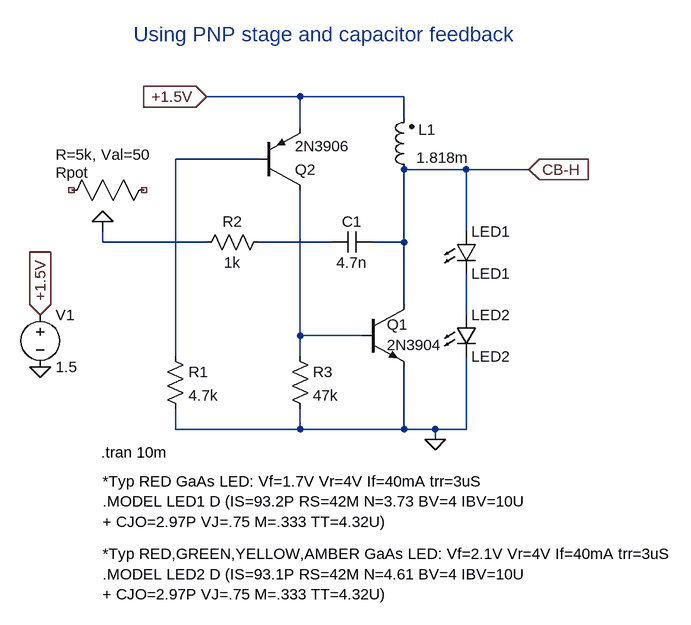
[diagram p0: schematic using_pnp_stage_and_cap_feedback_ltspice.asc]
using_pnp_stage_and_cap_feedback_ltspice.asc, the LTspice schematic file:
Version 4
SHEET 1 900 968
WIRE 112 128 -32 128
WIRE 272 128 112 128
WIRE 272 160 272 128
WIRE 112 176 112 128
WIRE 48 224 -80 224
WIRE 368 240 272 240
WIRE 464 240 368 240
WIRE 368 336 368 240
WIRE -192 352 -192 336
WIRE -32 352 -192 352
WIRE 160 352 48 352
WIRE 272 352 272 240
WIRE 272 352 224 352
WIRE 272 448 272 352
WIRE 368 464 368 400
WIRE 112 496 112 272
WIRE 208 496 112 496
WIRE -80 528 -80 224
WIRE 112 528 112 496
WIRE -80 640 -80 608
WIRE 112 640 112 608
WIRE 112 640 -80 640
WIRE 272 640 272 544
WIRE 272 640 112 640
WIRE 320 640 272 640
WIRE 368 640 368 528
WIRE 368 640 320 640
WIRE 320 656 320 640
FLAG -32 128 +1.5V
IOPIN -32 128 In
FLAG 320 656 0
FLAG 464 240 CB-H
IOPIN 464 240 In
FLAG -288 544 0
FLAG -288 464 +1.5V
IOPIN -288 464 In
SYMBOL ind2 288 256 R180
WINDOW 0 -33 77 Left 2
WINDOW 3 -3 34 Right 2
SYMATTR InstName L1
SYMATTR Value 1.818m
SYMATTR Type ind
SYMBOL LED 352 336 R0
SYMATTR InstName LED1
SYMATTR Value LED1
SYMBOL LED 352 464 R0
SYMATTR InstName LED2
SYMATTR Value LED2
SYMBOL npn 208 448 R0
WINDOW 0 38 31 Left 2
WINDOW 3 38 62 Left 2
SYMATTR InstName Q1
SYMATTR Value 2N3904
SYMBOL res 64 336 R90
WINDOW 0 0 56 VBottom 2
WINDOW 3 32 56 VTop 2
SYMATTR InstName R2
SYMATTR Value 1k
SYMBOL potentiometer -224 288 R270
WINDOW 0 43 -40 VRight 2
WINDOW 39 71 -40 VRight 2
SYMATTR InstName Rpot
SYMATTR SpiceLine R=5k, Val=50
SYMBOL pnp 48 272 M180
SYMATTR InstName Q2
SYMATTR Value 2N3906
SYMBOL res 96 512 R0
SYMATTR InstName R3
SYMATTR Value 47k
SYMBOL res -96 512 R0
SYMATTR InstName R1
SYMATTR Value 4.7k
SYMBOL cap 224 336 R90
WINDOW 0 0 32 VBottom 2
WINDOW 3 32 32 VTop 2
SYMATTR InstName C1
SYMATTR Value 4.7n
SYMBOL voltage -288 448 R0
SYMATTR InstName V1
SYMATTR Value 1.5
TEXT -144 32 Left 3 ;Using PNP stage and capacitor feedback
TEXT -192 720 Left 2 !*Typ RED GaAs LED: Vf=1.7V Vr=4V If=40mA trr=3uS\n.MODEL LED1 D (IS=93.2P RS=42M N=3.73 BV=4 IBV=10U\n+ CJO=2.97P VJ=.75 M=.333 TT=4.32U)
TEXT -192 832 Left 2 !*Typ RED,GREEN,YELLOW,AMBER GaAs LED: Vf=2.1V Vr=4V If=40mA trr=3uS\n.MODEL LED2 D (IS=93.1P RS=42M N=4.61 BV=4 IBV=10U\n+ CJO=2.97P VJ=.75 M=.333 TT=4.32U)
TEXT -194 676 Left 2 !.tran 10m

The netlist it stands for:
* using_pnp_stage_and_cap_feedback_ltspice.asc
L1 CB-H +1.5V 1.818m
D§LED1 CB-H N004 LED1
D§LED2 N004 0 LED2
Q1 CB-H N005 0 0 2N3904
R2 N003 N002 1k
XRpot NC_01 N002 NC_02 potentiometer R=5k, Val=50  ; pins 1 2 3
Q2 N005 N001 +1.5V 0 2N3906
R3 N005 0 47k
R1 N001 0 4.7k
C1 CB-H N003 4.7n
V1 +1.5V 0 1.5
.model D D
.lib standard.dio
.model NPN NPN
.model PNP PNP
.lib standard.bjt
* Using PNP stage and capacitor feedback
*Typ RED GaAs LED: Vf=1.7V Vr=4V If=40mA trr=3uS
.MODEL LED1 D (IS=93.2P RS=42M N=3.73 BV=4 IBV=10U
+ CJO=2.97P VJ=.75 M=.333 TT=4.32U)
*Typ RED,GREEN,YELLOW,AMBER GaAs LED: Vf=2.1V Vr=4V If=40mA trr=3uS
.MODEL LED2 D (IS=93.1P RS=42M N=4.61 BV=4 IBV=10U
+ CJO=2.97P VJ=.75 M=.333 TT=4.32U)
.tran 10m
.backanno
.end